# EAGLE design MT9D111_interface (EAGLE 8.2.0)
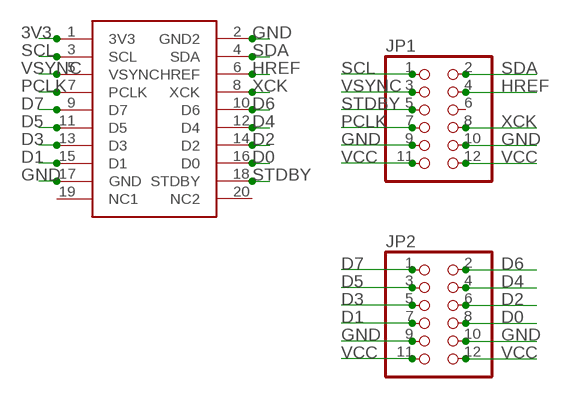
[diagram p0: schematic, sheet 1]

## Parts
JP1  PINHD-2X6  [2X06]
JP2  PINHD-2X6  [2X06]
U$1  MT9D111  [10-2]

## Nets
3V3: U$1.1(3V3)
D0: JP2.8 U$1.16(D0)
D1: JP2.7 U$1.15(D1)
D2: JP2.6 U$1.14(D2)
D3: JP2.5 U$1.13(D3)
D4: JP2.4 U$1.12(D4)
D5: JP2.3 U$1.11(D5)
D6: JP2.2 U$1.10(D6)
D7: JP2.1 U$1.9(D7)
GND: JP1.9 JP1.10 JP2.9 JP2.10 U$1.2(GND2) U$1.17(GND)
HREF: JP1.4 U$1.6(HREF)
PCLK: JP1.7 U$1.7(PCLK)
SCL: JP1.1 U$1.3(SCL)
SDA: JP1.2 U$1.4(SDA)
STDBY: JP1.5 U$1.18(STDBY)
VCC: JP1.11 JP1.12 JP2.11 JP2.12
VSYNC: JP1.3 U$1.5(VSYNC)
XCK: JP1.8 U$1.8(XCK)
Unconnected: JP1.6 U$1.19(NC1) U$1.20(NC2)

## Library data of the parts
JP1 JP2 = pinhead:PINHD-2X6: PIN HEADER
U$1 = MT9D111:MT9D111

## Board
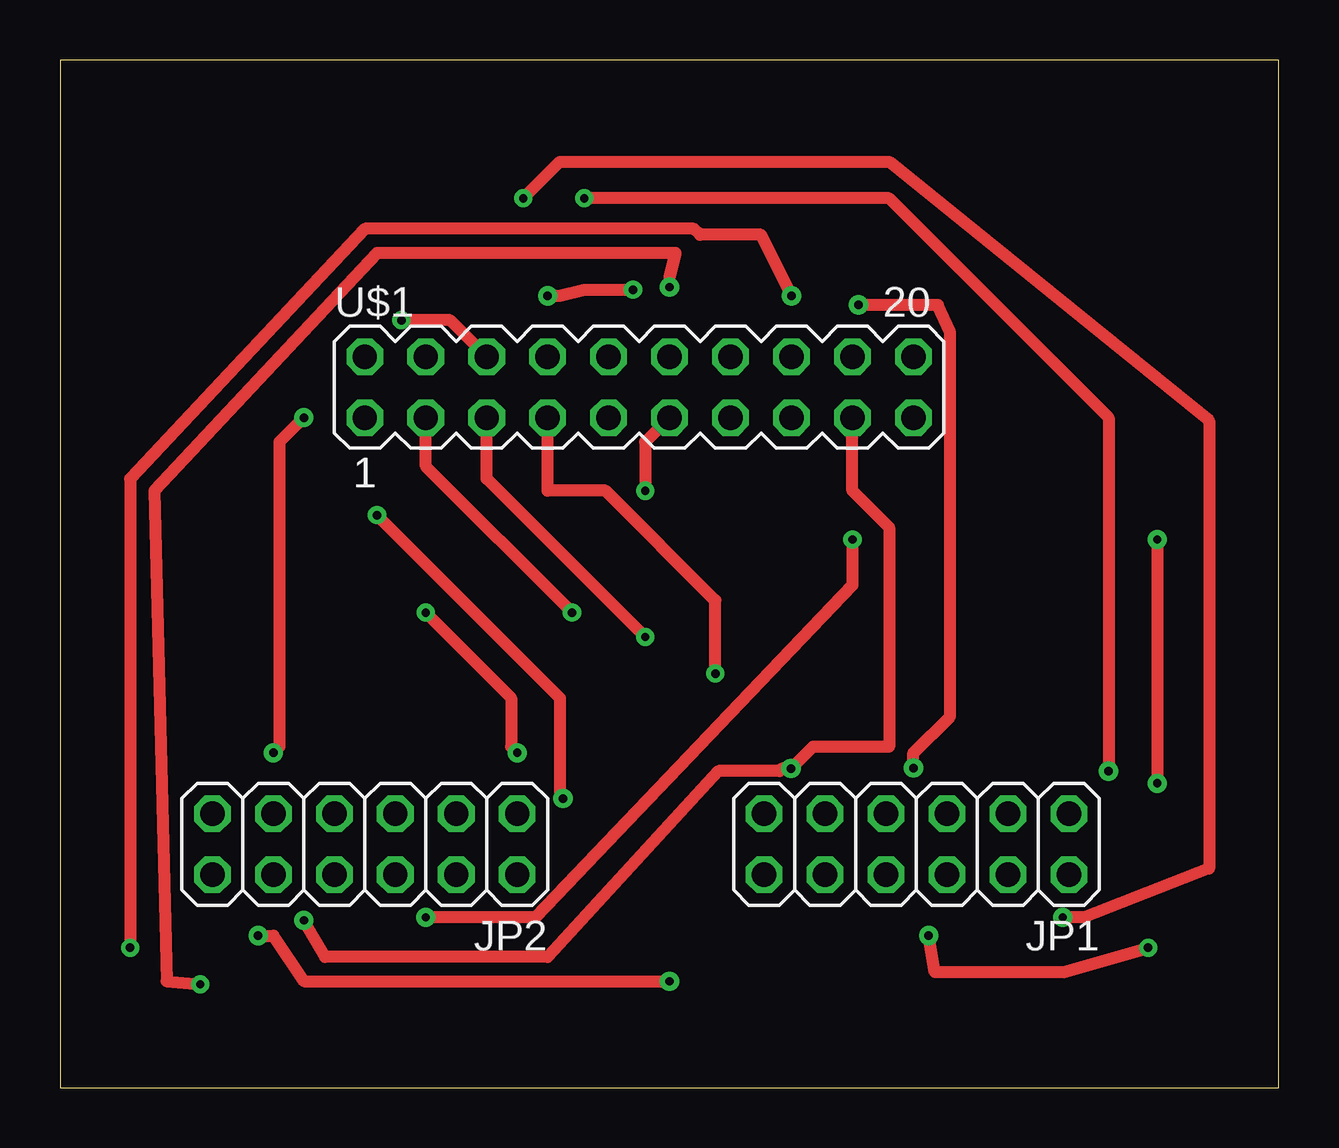
[diagram p1: board, top side]
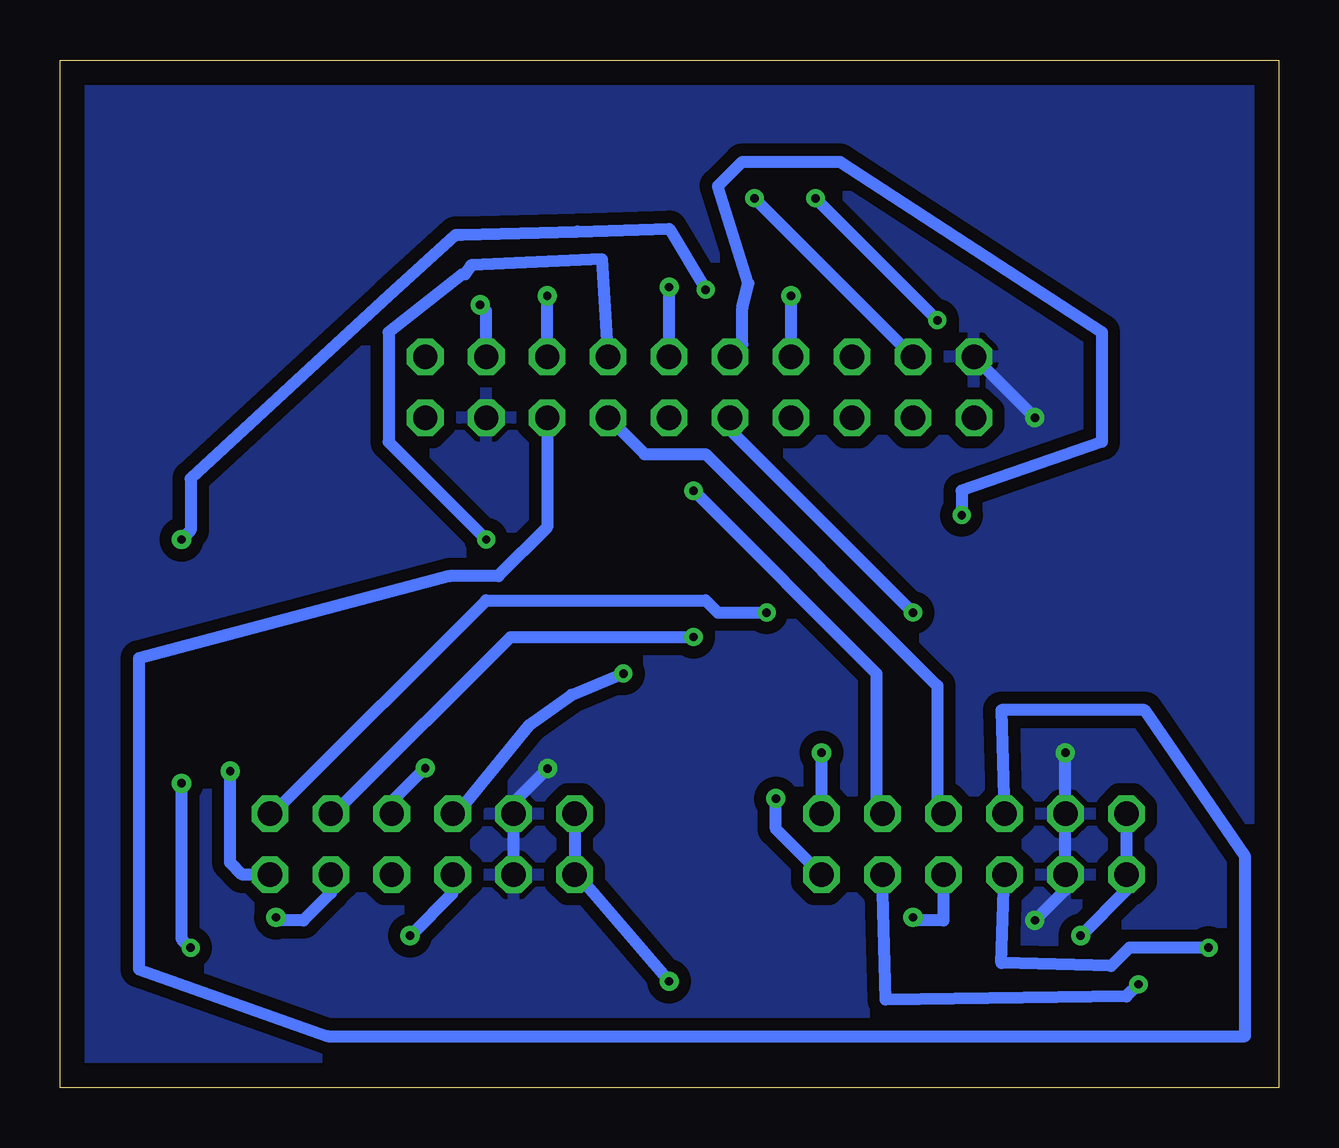
[diagram p2: board, bottom side, seen from below]

Size 50.78 x 42.85 mm. Coordinates in mm from the lower left corner, seen from the top.
Outline: 0,0 50.78,0 50.78,42.85 0,42.85 0,0
Copper layers (1*16): Top 0.035mm / dielectric 1.5mm / Bottom 0.035mm
Design rules "default *": minimum track width 20mil, minimum drill 0.35mm, track to track 20mil, track to pad 20mil, pad to pad 20mil, via to via 20mil, smd to smd 20mil, copper to edge 40mil, drill to drill 6mil, minimum pad ring 10mil, minimum via ring 8mil, stop-mask expansion 4mil, vias tented up to drill 0mil, thermal gap 10mil

### Footprints (pad centres in the part's own frame; a part is rotated, then mirrored left to right if it is on the bottom)
2X06 = drill 1.016 octagon: 1 -6.35,-1.27; 2 -6.35,1.27; 3 -3.81,-1.27; 4 -3.81,1.27; 5 -1.27,-1.27; 6 -1.27,1.27; 7 1.27,-1.27; 8 1.27,1.27; 9 3.81,-1.27; 10 3.81,1.27; 11 6.35,-1.27; 12 6.35,1.27
10-2 = drill 1.016 octagon: 1 -11.43,-1.27; 2 -11.43,1.27; 3 -8.89,-1.27; 4 -8.89,1.27; 5 -6.35,-1.27; 6 -6.35,1.27; 7 -3.81,-1.27; 8 -3.81,1.27; 9 -1.27,-1.27; 10 -1.27,1.27; 11 1.27,-1.27; 12 1.27,1.27; 13 3.81,-1.27; 14 3.81,1.27; 15 6.35,-1.27; 16 6.35,1.27; 17 8.89,-1.27; 18 8.89,1.27; 19 11.43,-1.27; 20 11.43,1.27

### Placement (x,y rotation side)
JP1  35.69,10.16 180 top
JP2  12.7,10.16 180 top
U$1  24.13,29.21 0 top

### Tracks (layer width: path | path; a pad name or v marks a point on that pad's centre or on a via)
D0  (via drill 0.35, 0.35 pad 0.8)
  Top 0.508: v2.92,5.84 2.92,25.4 12.7,35.81 26.42,35.81 26.67,35.56 29.21,35.56 v30.48,33.02
  Bottom 0.508: JP2.8 11.56,5.21 6.99,5.08 6.22,5.84 v2.92,5.84 | U$1.16 v30.48,33.02
D1
  Bottom 0.508: JP2.7 11.56,15.75 5.59,15.75 1.4,9.65 1.4,2.16 39.62,2.16 47.5,4.95 47.5,17.91 34.54,21.34 32.51,21.34 30.48,23.37 U$1.15
D2  (via drill 0.35, 0.35 pad 0.8)
  Top 0.508: v15.24,7.11 19.81,7.11 33.02,20.95 v33.02,22.86
  Bottom 0.508: v33.02,22.86 37.08,26.92 37.08,31.5 34.04,33.91 33.91,33.91 33.66,34.29 28.19,34.54 U$1.14 | JP2.6 13.97,6.99 15.11,6.99 v15.24,7.11
D3
  Bottom 0.508: U$1.13 26.42,26.42 23.88,26.42 14.22,16.76 14.22,11.68 JP2.5
D4  (via drill 0.35, 0.35 pad 0.8)
  Top 0.508: v5.84,4.32 4.45,4.45 3.94,24.89 13.21,34.8 25.65,34.8 25.4,33.78 v25.4,33.38
  Bottom 0.508: JP2.4 16.38,3.68 6.35,3.81 v5.84,4.32 | U$1.12 v25.4,33.38 25.4,32.26
D5  (via drill 0.35)
  Top 0.508: v24.38,24.89 24.38,26.92 U$1.11
  Bottom 0.508: v24.38,24.89 16.76,17.27 16.76,11.68 JP2.3
D6  (via drill 0.35, 0.35 pad 0.8)
  Top 0.508: v13.21,23.88 20.83,16.26 20.83,12.19 v20.95,12.06
  Bottom 0.508: v13.21,23.88 13.21,24.89 7.37,26.92 7.37,31.5 18.29,38.61 22.35,38.61 23.37,37.59 22.1,33.53 22.35,32.51 22.35,30.99 U$1.10 | JP2.2 20.95,10.79 v20.95,12.06
D7  (via drill 0.35, 0.35 pad 0.8)
  Top 0.508: v15.24,19.81 18.8,16.26 18.8,14.22 v19.05,13.97
  Bottom 0.508: v15.24,19.81 22.86,27.43 U$1.9 | JP2.1 v19.05,13.97
GND  (via drill 0.35 pad 0.8)
  Top 0.508: U$1.17 33.02,24.89 34.54,23.37 34.54,14.22 31.37,14.22 v30.46,13.31 30.08,13.31 29.97,13.21 27.43,13.21 20.32,5.46 11.05,5.46 v10.16,6.99 | v10.16,27.94 9.14,26.92 9.14,14.22 v8.89,13.97
  Bottom 0.508: U$1.2 v10.16,27.94 | JP1.10 JP1.9 31.88,11.9 v30.46,13.31 | v8.89,13.97 JP2.9 JP2.10 8.89,8.26 v10.16,6.99
  pour Bottom: 0,0 50.8,0 50.8,43.18 0,43.18
HREF  (via drill 0.35, 0.35 pad 0.8)
  Top 0.508: v41.78,7.11 42.67,7.11 47.88,9.14 47.88,27.81 34.54,38.61 20.83,38.61 v19.3,37.08 | v14.22,32 16.26,32 U$1.6
  Bottom 0.508: v14.22,32 v19.3,37.08 | JP1.4 39.5,8.13 40.64,6.99 41.66,6.99 v41.78,7.11
PCLK  (via drill 0.35)
  Top 0.508: U$1.7 20.32,24.89 22.73,24.89 27.3,20.32 v27.3,17.27
  Bottom 0.508: v27.3,17.27 29.46,16.38 31.24,15.11 34.04,11.68 JP1.7
SCL  (via drill 0.35)
  Top 0.508: U$1.3 15.24,25.91 v21.34,19.81
  Bottom 0.508: v21.34,19.81 23.37,19.81 23.88,20.32 33.02,20.32 41.66,11.68 JP1.1
SDA  (via drill 0.35, 0.35 pad 0.8)
  Top 0.508: v21.84,37.08 34.54,37.08 43.69,27.94 v43.69,13.21
  Bottom 0.508: v21.84,37.08 U$1.4 | JP1.2 43.18,8.89 43.69,9.4 v43.69,13.21
STDBY  (via drill 0.35 pad 0.8)
  Top 0.508: v33.27,32.64 36.58,32.64 37.08,31.5 37.08,15.49 35.56,13.97 v35.56,13.34
  Bottom 0.508: U$1.18 33.02,32.38 v33.27,32.64 | JP1.5 36.96,11.94 v35.56,13.34
VCC  (via drill 0.35 pad 0.8)
  Top 0.508: v25.4,4.45 10.16,4.45 8.89,6.35 v8.26,6.35
  Bottom 0.508: JP1.11 JP1.12 29.21,8.89 v25.4,4.45 | JP2.11 JP2.12 6.35,8.26 v8.26,6.35
VSYNC  (via drill 0.35)
  Top 0.508: U$1.5 17.78,25.4 v24.38,18.8
  Bottom 0.508: v24.38,18.8 32,18.8 39.12,11.68 JP1.3
XCK  (via drill 0.35, 0.35 pad 0.8)
  Top 0.508: v23.88,33.27 21.84,33.27 20.83,33.02 v20.32,33.02 | v45.34,5.84 41.78,4.83 36.45,4.83 v36.2,6.35 | v45.72,22.86 v45.72,12.7
  Bottom 0.508: v23.88,33.27 25.4,35.81 29.21,35.7 34.04,35.56 34.29,35.56 37.08,33.02 45.34,25.4 45.34,23.24 v45.72,22.86 | U$1.8 v20.32,33.02 | JP1.8 34.42,8.13 v36.2,6.35 | v45.72,12.7 45.72,6.22 v45.34,5.84